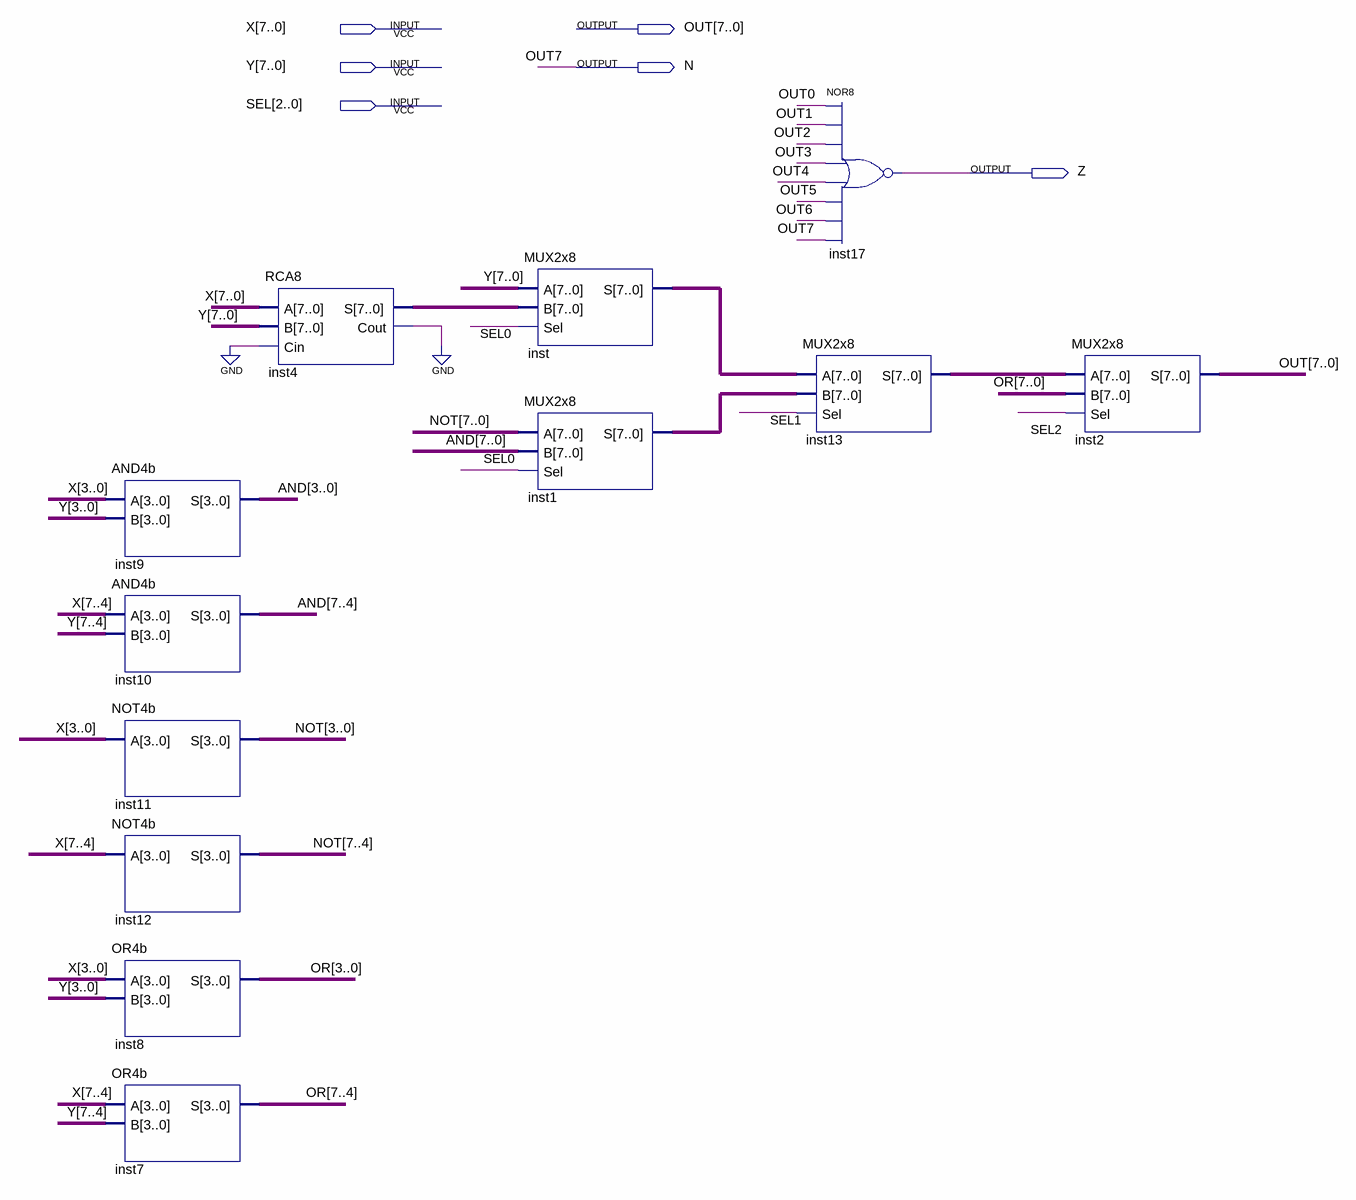
[diagram p0: schematic sheet]
// Quartus schematic ULA8.bdf as structural Verilog: 12 symbols, 6 pins
module ULA8 (
  input  [7:0] X,
  input  [7:0] Y,
  input  [2:0] SEL,
  output [7:0] OUT,
  output N,
  output Z
);

  wire inst4_cout;
  wire [7:0] AND, inst1_s, inst4_s, inst13_s, inst_s, NOT, OR;

  AND4b inst9 (.A(X[3:0]), .B(Y[3:0]), .S(AND[3:0]));
  AND4b inst10 (.A(X[7:4]), .B(Y[7:4]), .S(AND[7:4]));
  NOT4b inst11 (.A(X[3:0]), .S(NOT[3:0]));
  NOT4b inst12 (.A(X[7:4]), .S(NOT[7:4]));
  OR4b inst8 (.A(X[3:0]), .B(Y[3:0]), .S(OR[3:0]));
  OR4b inst7 (.A(X[7:4]), .B(Y[7:4]), .S(OR[7:4]));
  RCA8 inst4 (.A(X), .B(Y), .Cin(1'b0), .S(inst4_s), .Cout(inst4_cout));
  MUX2x8 inst (.A(Y), .B(inst4_s), .Sel(SEL[0]), .S(inst_s));
  MUX2x8 inst1 (.A(NOT), .B(AND), .Sel(SEL[0]), .S(inst1_s));
  nor inst17 (Z, OUT[0], OUT[1], OUT[2], OUT[3], OUT[4], OUT[5], OUT[6], N);
  MUX2x8 inst13 (.A(inst_s), .B(inst1_s), .Sel(SEL[1]), .S(inst13_s));
  MUX2x8 inst2 (.A(inst13_s), .B(OR), .Sel(SEL[2]), .S({N, OUT[6:0]}));

  assign OUT[7] = N;
  // also tied to GND on the sheet: inst4_cout

  // Other names for the same wires on the sheet: OUT7 = N
endmodule
